# Altium project Turkin_IVT23_1D.PrjPcb
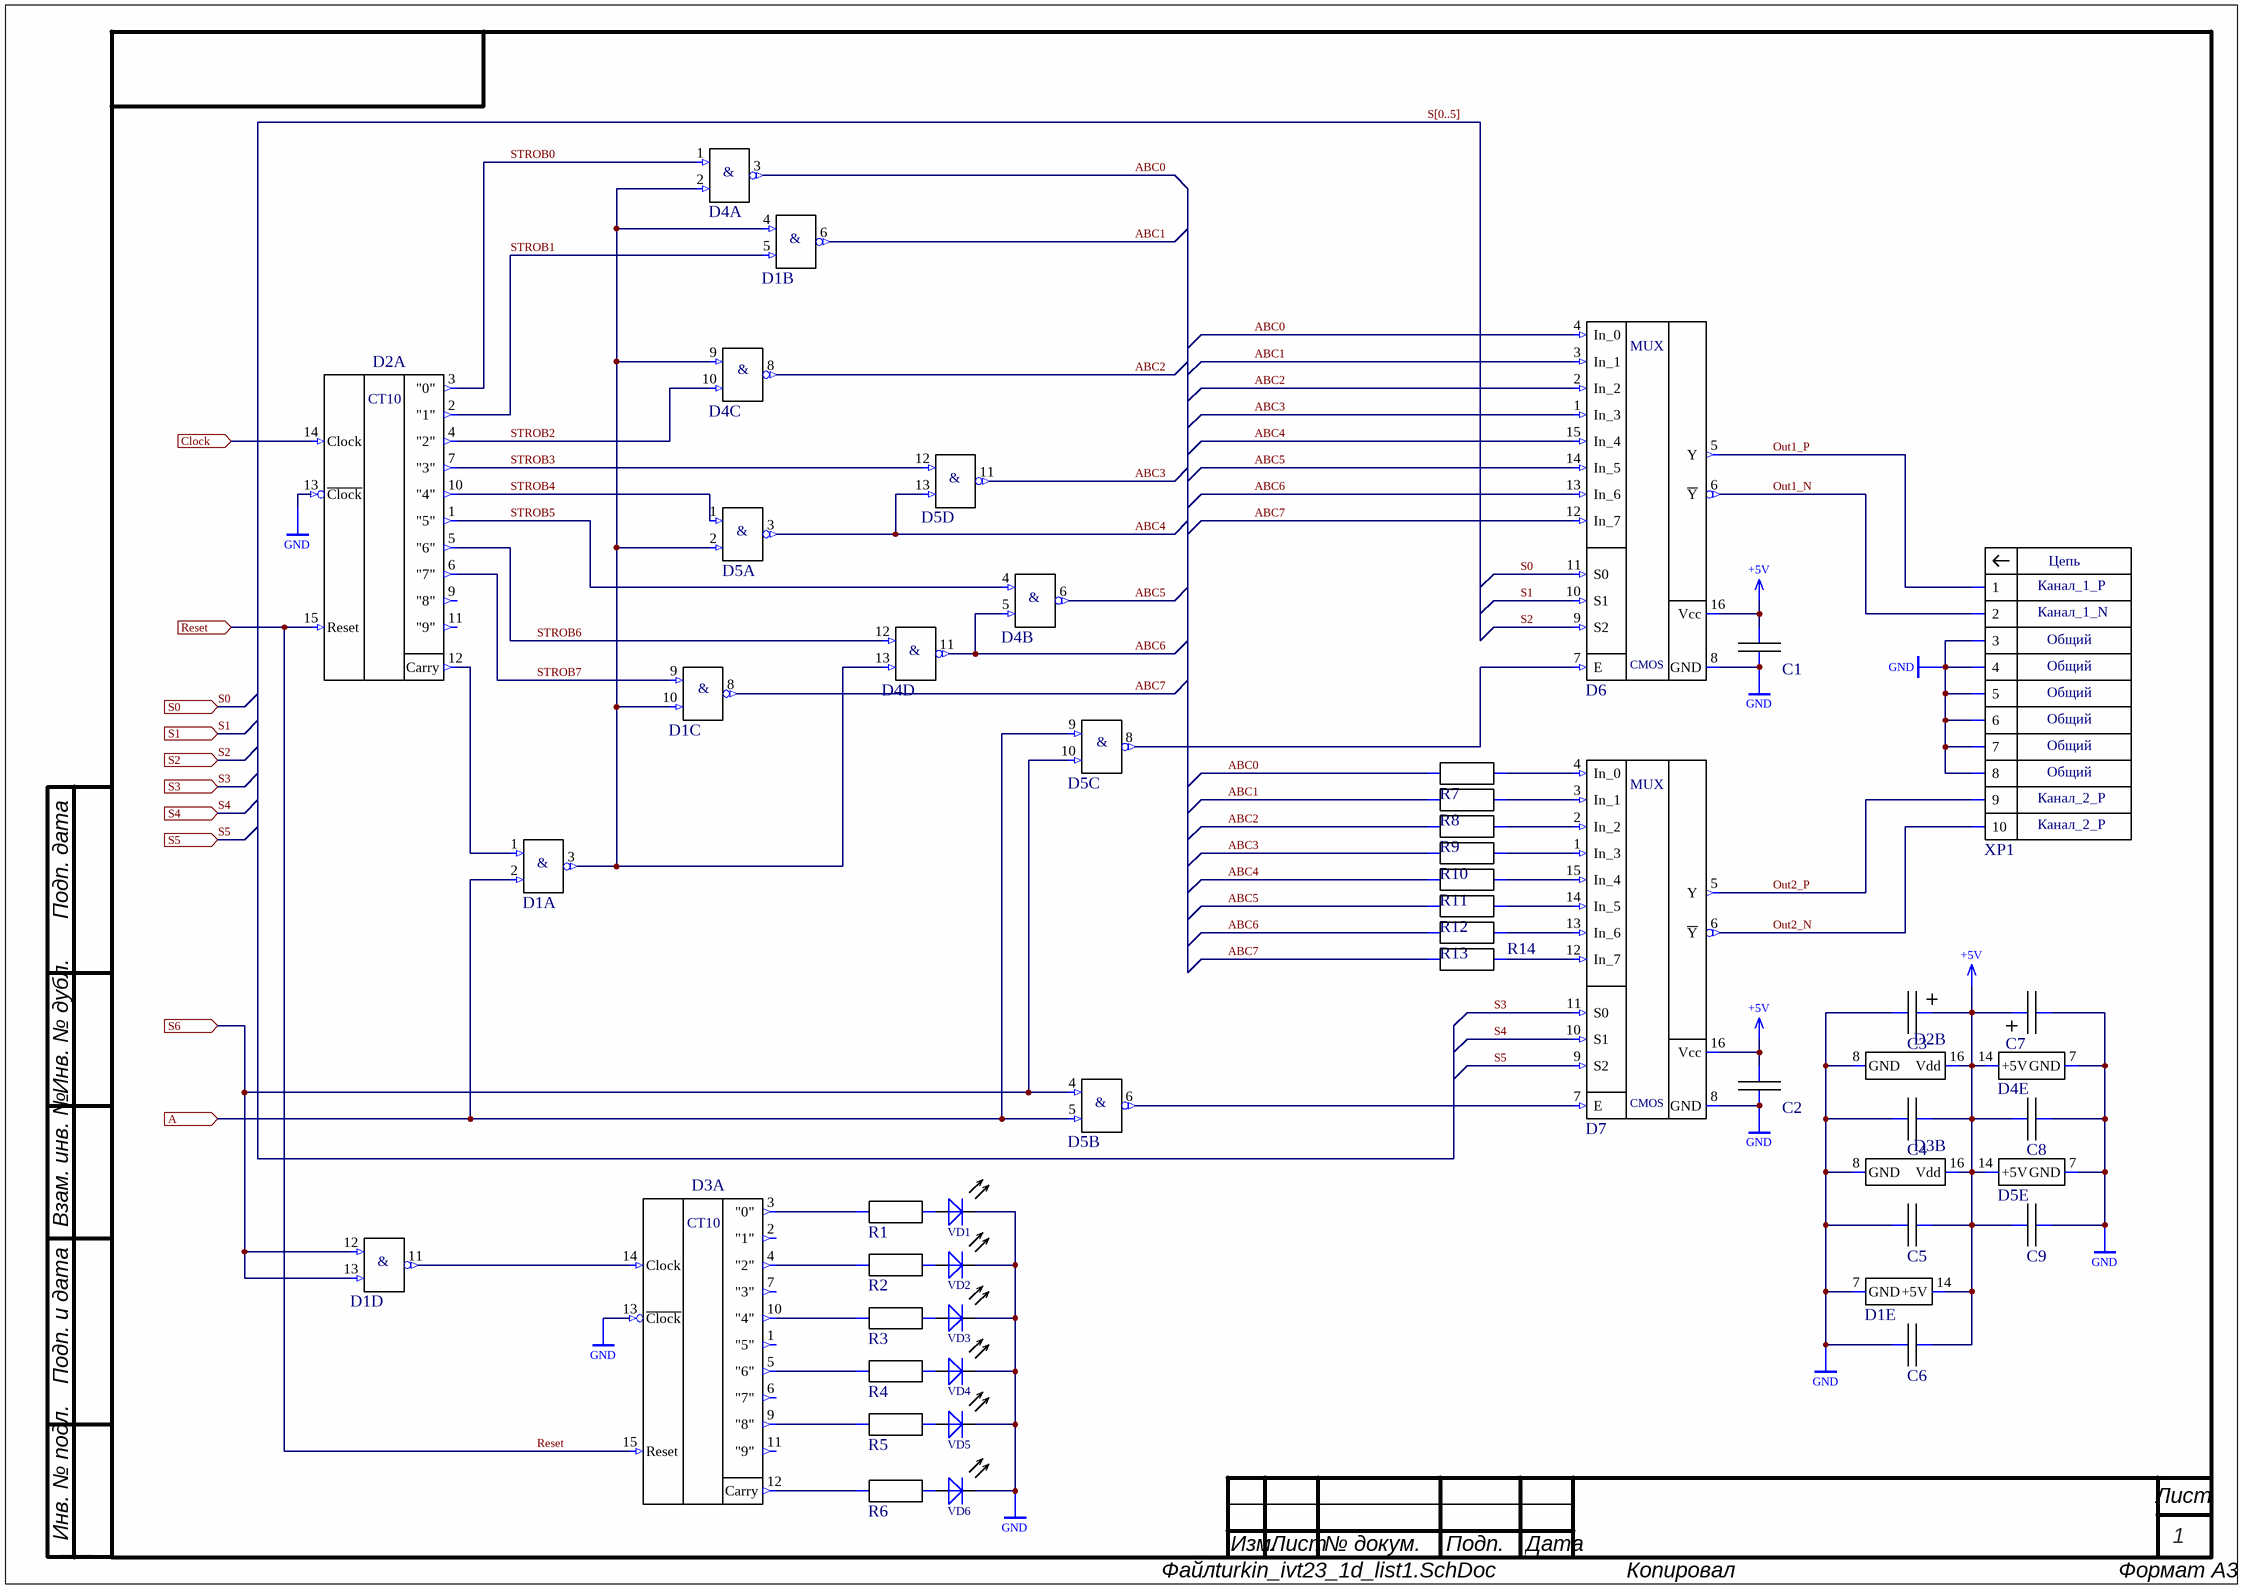
[diagram p0: turkin_ivt23_1d_list1.SchDoc]
2 sheets, 50 parts. Net scope: flat (ports and power ports of the same name join across sheets).
Board file: turkin_ivt23_1d_PCB1.PcbDoc
Sheets:
  turkin_ivt23_1d_list1.SchDoc
  turkin_ivt23_1d_list2.SchDoc

## Sheet turkin_ivt23_1d_list1.SchDoc
size 420 x 297 mm; SheetNumber: 1; SheetTotal: 2

### Parts
C1  (no value)  [0805_N]
C2  (no value)  [0805_N]
C3  C  [C-Tantal]  (value not drawn)
C4  (no value)  [0805_N]
C5  (no value)  [0805_N]
C6  (no value)  [0805_N]
C7  C  [C-Tantal]  (value not drawn)
C8  (no value)  [0805_N]
C9  (no value)  [0805_N]
D1  74AC00SC  [SO14-N]  (value not drawn)  (parts A,B,C,D,E of 5)
D2  DIP-16  [DIP16]  (value not drawn)  (parts A,B of 2)
D3  DIP-16  [DIP16]  (value not drawn)  (parts A,B of 2)
D4  74AC00SC  [SO14-N]  (value not drawn)  (parts A,B,C,D,E of 5)
D5  74AC00SC  [SO14-N]  (value not drawn)  (parts A,B,C,D,E of 5)
D6  SOIC-16  [SO16-N]  (value not drawn)
D7  SOIC-16  [SO16-N]  (value not drawn)
R1  0805  [RES_0805_2012_N]  (value not drawn)
R2  0805  [RES_0805_2012_N]  (value not drawn)
R3  0805  [RES_0805_2012_N]  (value not drawn)
R4  0805  [RES_0805_2012_N]  (value not drawn)
R5  0805  [RES_0805_2012_N]  (value not drawn)
R6  0805  [RES_0805_2012_N]  (value not drawn)
R7  0805  [RES_0805_2012_N]  (value not drawn)
R8  0805  [RES_0805_2012_N]  (value not drawn)
R9  0805  [RES_0805_2012_N]  (value not drawn)
R10  0805  [RES_0805_2012_N]  (value not drawn)
R11  0805  [RES_0805_2012_N]  (value not drawn)
R12  0805  [RES_0805_2012_N]  (value not drawn)
R13  0805  [RES_0805_2012_N]  (value not drawn)
R14  0805  [RES_0805_2012_N]  (value not drawn)
VD1  521-9466  [521-9466]  (value not drawn)
VD2  521-9466  [521-9466]  (value not drawn)
VD3  521-9466  [521-9466]  (value not drawn)
VD4  521-9466  [521-9466]  (value not drawn)
VD5  521-9466  [521-9466]  (value not drawn)
VD6  521-9466  [521-9466]  (value not drawn)
XP1  TE_1-1634689-0  [BH-10R]  (value not drawn)

### Ports
A (in), Clock (in), Reset (in), S0 (in), S1 (in), S2 (in), S3 (in), S4 (in), S5 (in), S6 (in)

### Nets
+5V: C1.2 C2.2 C3.+ C4.1 C5.1 C6.1 C7.+ C8.2 C9.2 D1.14(+5V) D2.16(Vdd) D3.16(Vdd) D4.14(+5V) D5.14(+5V) D6.16(Vcc) D7.16(Vcc)
GND: C1.1 C2.1 C3.- C4.2 C5.2 C6.2 C7.- C8.1 C9.1 D1.7(GND) D2.8(GND) D2.13(~{Clock}) D3.8(GND) D3.13(~{Clock}) D4.7(GND) D5.7(GND) D6.8(GND) D7.8(GND) VD1.C VD2.C VD3.C VD4.C VD5.C VD6.C XP1.3 XP1.4 XP1.5 XP1.6 XP1.7 XP1.8
ABC0: D4.3(Out) D6.4(In_0) R7.1
ABC1: D1.6(Out) D6.3(In_1) R8.1
ABC2: D4.8(Out) D6.2(In_2) R9.1
ABC3: D5.11(Out) D6.1(In_3) R10.1
ABC4: D5.3(Out) D5.13(In2) D6.15(In_4) R11.1
ABC5: D4.6(Out) D6.14(In_5) R12.1
ABC6: D4.5(In2) D4.11(Out) D6.13(In_6) R13.1
ABC7: D1.8(Out) D6.12(In_7) R14.1
Out1_N: D6.6(~{Y}) XP1.2
Out1_P: D6.5(Y) XP1.1
Out2_N: D7.6(~{Y}) XP1.10
Out2_P: D7.5(Y) XP1.9
Reset: D2.15(Reset) D3.15(Reset) ; port Reset
S0: D6.11(S0) ; port S0
S1: D6.10(S1) ; port S1
S2: D6.9(S2) ; port S2
S3: D7.11(S0) ; port S3
S4: D7.10(S1) ; port S4
S5: D7.9(S2) ; port S5
STROB0: D2.3("0") D4.1(In1)
STROB1: D1.5(In2) D2.2("1")
STROB2: D2.4("2") D4.10(In2)
STROB3: D2.7("3") D5.12(In1)
STROB4: D2.10("4") D5.1(In1)
STROB5: D2.1("5") D4.4(In1)
STROB6: D2.5("6") D4.12(In1)
STROB7: D1.9(In1) D2.6("7")
NetD1_1: D1.1(In1) D2.12(Carry)
NetD1_2: D1.2(In2) D5.5(In2) D5.9(In1) ; port A
NetD1_3: D1.3(Out) D1.4(In1) D1.10(In2) D4.2(In2) D4.9(In1) D4.13(In2) D5.2(In2)
NetD1_11: D1.11(Out) D3.14(Clock)
NetD1_12: D1.12(In1) D1.13(In2) D5.4(In1) D5.10(In2) ; port S6
NetD2_14: D2.14(Clock) ; port Clock
NetD3_3: D3.3("0") R1.1
NetD3_4: D3.4("2") R2.1
NetD3_5: D3.5("6") R4.1
NetD3_9: D3.9("8") R5.1
NetD3_10: D3.10("4") R3.1
NetD3_12: D3.12(Carry) R6.1
NetD5_6: D5.6(Out) D7.7(E)
NetD5_8: D5.8(Out) D6.7(E)
NetD7_1: D7.1(In_3) R10.2
NetD7_2: D7.2(In_2) R9.2
NetD7_3: D7.3(In_1) R8.2
NetD7_4: D7.4(In_0) R7.2
NetD7_12: D7.12(In_7) R14.2
NetD7_13: D7.13(In_6) R13.2
NetD7_14: D7.14(In_5) R12.2
NetD7_15: D7.15(In_4) R11.2
NetR1_2: R1.2 VD1.A
NetR2_2: R2.2 VD2.A
NetR3_2: R3.2 VD3.A
NetR4_2: R4.2 VD4.A
NetR5_2: R5.2 VD5.A
NetR6_2: R6.2 VD6.A

Not connected (* = marked no-connect by the designer): D2 9("8") 11("9"); D3 1("5") 2("1") 6("7") 7("3") 11("9")

### Buses and harness runs
bus S[0..5]

### Notes on the sheet
- (near XP1) Канал_1_P
- (near XP1) Канал_1_N
- Общий
- (near XP1) Канал_2_P
- Подп. дата
- Инв. № дубл.
- Взам. инв. №
- Подп. и дата
- Инв. № подл.
- Изм.
- Лист
- № докум.
- Подп.
- Дата
- ALTIUM GOSTBOM2.0 KEV
- Файл:
- Копировал
- Формат А3
- (in symbol 74AC00SC, part A) &
- (in symbol 74AC00SC, part B) &
- (in symbol 74AC00SC, part C) &
- (in symbol 74AC00SC, part D) &
- (in symbol 74HC151D) MUX; CMOS
- (in symbol HCF4017BEY, part A) CT10
- (in symbol TE_1-1634689-0) Цепь

### Library data of the parts
C1 C2 C4-C6 C8 C9 = К10-79_0805_Н90: Чип конденсатор 0805 Н90 ряд Е6; Manufacturer: ООО "Кулон"; Name: К10-79; Tolerance: +80%-20%; TU: АЖЯР.673511.004 ТУ; Type: K10-79; Voltage: 25В; Value: 0.1мкФ; BOM: К10-79-25В-B-*+80%-20%-Н90 АЖЯР.673511.004 ТУ; Created_by: Желобаев; Name2: Конденсатор К10-79; Version: 0; Weight: 0.05; TKE: Н90; Value_KD: *; Case: 0805; Issue_date: 19_12_2018
C3 C7 = K53-65_C_10%: К53-65 Конденсатор танталовый C(6032) 0,47-100 мкФ; Manufacturer: ОАО "Элеконд"; Value: 10мкФ; Voltage: 16В; TU: АЖЯР.673546.004 ТУ; Tolerance: 10%; Created_by: Желобаев; BOM: К53-65 "C" - 16ВB - 10мкФмкФ ±10% АЖЯР.673546.004 ТУ; Name2: Конденсатор К53-65; Weight: 0,3; Version: 0; Issue_date: 6.01.2019; Size: C; Name: К53-65; Case: C
D1 D4 D5 = 74AC00SC: 4 элемента 2И-НЕ TTL SOIC-14; Manufacturer: ON Semiconductor; BOM: 74AC00SC "ON Semiconductor"; Created_by: Желобаев; Power_Voltage: 4.5 - 5.5 V; Name2: Микросхема 74AC00SC; Issue_date: 10.04.2019; Case: SOIC-14; Version: 0; Name: 74AC00SC
D2 D3 = HCF4017BEY: Декадный счетчик c 10 декодированными выходами; Manufacturer: STMicroelectronics; Power_Voltage: -0.5 -22 V; BOM: HCF4017BEY "STMicroelectronics"; Created_by: Желобаев; Name2: Микросхема HCF4017BEY; Case: DIP-16; Issue_date: 05.04.2019; Name: HCF4017BEY; Version: 0
D6 D7 = 74HC151D: мультиплексор 8 канальный CMOS; Manufacturer: NXP Semiconductors; Power_Voltage: 2.0 -6.0 V; BOM: 74HC151D "NXP Semiconductors"; Created_by: Желобаев; NAME2: Микросхема 74HC151D; Case: SOIC-16; Issue_date: 05.04.2019; Name: 74HC151D; Version: 0
R1-R14 = Р1-12-0,125-5%: Резистор от 0,75 Ом до 2 МОм; Manufacturer: ОАО "НПО "Эркон"; Tolerance: 5%; Created_by: Желобаев; TU: АЛЯР.434110.005 ТУ; Voltage: 150; TKR: M; BOM: Р1-12-0,125 * 5%-M-"A" АЛЯР.434110.005 ТУ; Value: 270Ом; Name2: Резистор Р1-12-0,125; Issue_Date: 05_12_2018; Version: 00; Type: Р1-12-0,125±5%-М-"А"; Weight: 0,01; Size: 0805; Name: Р1-12-0,125; Value_KD: *; Case: 0805
VD1-VD6 = 521-9466: Светодиод 5мм желтый; BOM: 521-9466 Dialight
XP1 = TE_1-1634689-0: Вилка типа BH-10R угловая правая двухрядная 2х5х2.54; Manufacturer: TE Connectivity; Created_by: Желобаев; BOM: TE_1-1634689-0 "TE Connectivity"; Name2: Вилка угловая TE_1-1634689-0; Name: TE_1-1634689-0; Issue_date: 13.05.2019; Version: 0; Case: BH-10R

## Sheet turkin_ivt23_1d_list2.SchDoc
size 420 x 297 mm; SheetNumber: 2; SheetTotal: 2
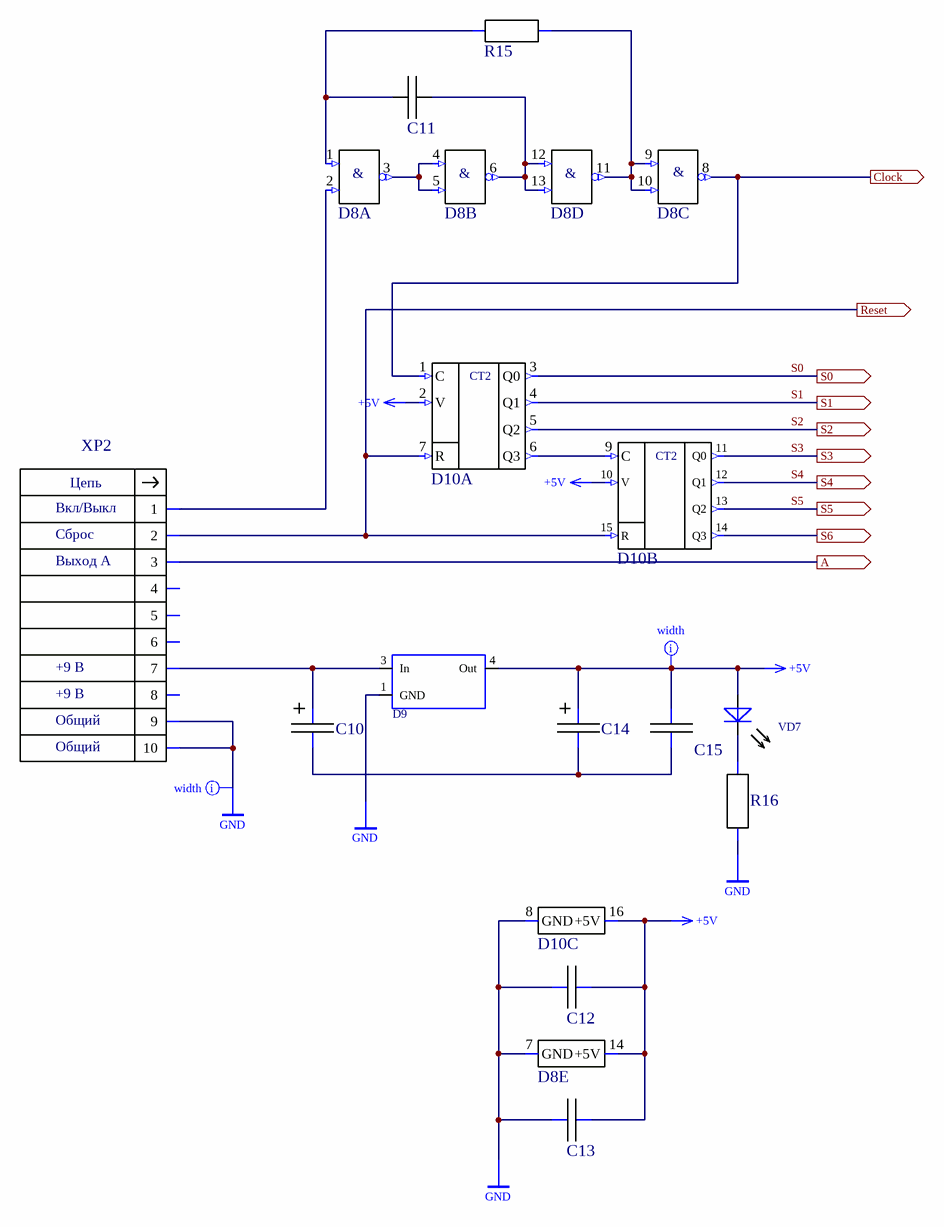
[diagram p1: turkin_ivt23_1d_list2.SchDoc]

### Parts
C10  C  [C-Tantal]  (value not drawn)
C11  1210  [K10-79_3.2_2.5(1210)]  (value not drawn)
C12  (no value)  [0805_N]
C13  (no value)  [0805_N]
C14  C  [C-Tantal]  (value not drawn)
C15  (no value)  [0805_N]
D8  74AC00SC  [SO14-N]  (value not drawn)  (parts A,B,C,D,E of 5)
D9  LM1117DTX-5.0/NOPB  [TO-252]  (value not drawn)
D10  (no value)  [DIP16]  (parts A,B,C of 3)
R15  (no value)  [RES_0603_1608_N]
R16  0805  [RES_0805_2012_N]  (value not drawn)
VD7  521-9466  [521-9466]  (value not drawn)
XP2  TE_1-1634689-0  [BH-10R]  (value not drawn)

### Ports
A (out), Clock (out), Reset (out), S0 (out), S1 (out), S2 (out), S3 (out), S4 (out), S5 (out), S6 (out)

### Nets
+5V: C12.2 C13.2 C14.+ C15.1 D8.14(+5V) D9.4(Out) D10.2(V) D10.10(V) D10.16(+5V) VD7.A
GND: C12.1 C13.1 D8.7(GND) D9.1(GND) D10.8(GND) R16.1 XP2.9 XP2.10
Reset: D10.7(R) D10.15(R) XP2.2 ; port Reset
S0: D10.3(Q0) ; port S0
S1: D10.4(Q1) ; port S1
S2: D10.5(Q2) ; port S2
S3: D10.11(Q0) ; port S3
S4: D10.12(Q1) ; port S4
S5: D10.13(Q2) ; port S5
NetC10_+: C10.+ D9.3(In) XP2.7
NetC10_-: C10.- C14.- C15.2
NetC11_1: C11.1 D8.1(In1) R15.1
NetC11_2: C11.2 D8.6(Out) D8.12(In1) D8.13(In2)
NetD1_2: XP2.3 ; port A
NetD1_12: D10.14(Q3) ; port S6
NetD2_14: D8.8(Out) D10.1(C) ; port Clock
NetD8_2: D8.2(In2) XP2.1
NetD8_3: D8.3(Out) D8.4(In1) D8.5(In2)
NetD8_9: D8.9(In1) D8.10(In2) D8.11(Out) R15.2
NetD10_6: D10.6(Q3) D10.9(C)
NetR16_2: R16.2 VD7.C

Not connected (* = marked no-connect by the designer): XP2 4 5 6 8

### Layout directives
mark named width: +5V, GND

### Notes on the sheet
- Сброс
- (near XP2) Вкл/Выкл
- Выход А
- +9 В
- Общий
- Подп. дата
- Инв. № дубл.
- Взам. инв. №
- Подп. и дата
- Инв. № подл.
- Изм.
- Лист
- № докум.
- Подп.
- Дата
- ALTIUM GOSTBOM2.0 KEV
- Файл:
- Копировал
- Формат А3
- (in symbol 74AC00SC, part A) &
- (in symbol 74AC00SC, part B) &
- (in symbol 74AC00SC, part C) &
- (in symbol 74AC00SC, part D) &
- (in symbol MC14520BCP, part A) CT2
- (in symbol MC14520BCP, part B) CT2
- (in symbol TE_1-1634689-0) Цепь

### Library data of the parts
C10 C14 = K53-65_C_10%: as C3 on sheet turkin_ivt23_1d_list1; Weight: 0,3; Version: 0; Issue_date: 6.01.2019; Size: C; Name: К53-65; Case: C
C11 = К10-79_1210_Н30: Чип конденсатор 1210 Н30 ряд Е6; Manufacturer: ООО "Кулон"; Name: Конденсатор К10-79; Reliability: 0.000005; Permit MPSU: разрешен; LiveStatus: производится; Packing: катушка; LibraryEngeneer: Желобаев; Tolerance: ±20%; Datum: 19_12_2018; TU: АЖЯР.673511.004 ТУ; Type: K10-79; Hight: 1.75; Voltage: 10В; Value_KD: 0.22мкФ; BOM: Конденсатор К10-79-10В-B-0.22мкФ±20%-Н30 АЖЯР.673511.004 ТУ; Version: 00; HelpURL: \\papa\Info\Altium_Library\Даташиты_и_ТУ\Конденсаторы_отечественные\К10-79_АЖЯР_673511_004ТУ.pdf; Weight: 0.2; TKE: Н30; Size: 1210; Value: *
C12 C13 C15 = К10-79_0805_Н90: as C1 on sheet turkin_ivt23_1d_list1; Version: 0; Weight: 0.05; TKE: Н90; Value_KD: *; Case: 0805; Issue_date: 19_12_2018
D8 = 74AC00SC: as D1 on sheet turkin_ivt23_1d_list1; Issue_date: 10.04.2019; Case: SOIC-14; Version: 0; Name: 74AC00SC
D10 = MC14520BCP: Два двоичных счетчика; Manufacturer: Motorola; Created_by: Желобаев; BOM: MC14520BCP "Motorola"; Name2: Микросхема MC14520BCP; Issue_date: 6.01.2019; Version: 0; Name: MC14520BCP; Case: DIP-16
R15 = Р1-12-0,1-5%: Резистор от 0,75 Ом до 10 МОм; Manufacturer: ОАО "НПО "Эркон"; Tolerance: 5%; TU: АЛЯР.434110.005 ТУ; Voltage: 50; TKR: M; BOM: Р1-12-0,1 * 5%-M-"A" АЛЯР.434110.005 ТУ; Value: 5.1КОм; Created_by: Желобаев; Name2: Резистор Р1-12-0,1; Version: 00; Type: Р1-12-0,1±5%-М-"А"; Weight: 0,005; Size: 0603; Name: Р1-12-0,1; Value_KD: *; Issue_date: 10.04.2019; Case: 0603
R16 = Р1-12-0,125-5%: as R1 on sheet turkin_ivt23_1d_list1; Issue_Date: 05_12_2018; Version: 00; Type: Р1-12-0,125±5%-М-"А"; Weight: 0,01; Size: 0805; Name: Р1-12-0,125; Value_KD: *; Case: 0805
VD7 = 521-9466: as VD1 on sheet turkin_ivt23_1d_list1
XP2 = TE_1-1634689-0: as XP1 on sheet turkin_ivt23_1d_list1; Name: TE_1-1634689-0; Issue_date: 13.05.2019; Version: 0; Case: BH-10R

## Nets that join several sheets
+5V: turkin_ivt23_1d_list1 (16 pins), turkin_ivt23_1d_list2 (10 pins)
GND: turkin_ivt23_1d_list1 (30 pins), turkin_ivt23_1d_list2 (8 pins)
NetD1_2: turkin_ivt23_1d_list1 (D1.2 D5.5 D5.9), turkin_ivt23_1d_list2 (XP2.3)
NetD1_12: turkin_ivt23_1d_list1 (D1.12 D1.13 D5.4 D5.10), turkin_ivt23_1d_list2 (D10.14)
NetD2_14: turkin_ivt23_1d_list1 (D2.14), turkin_ivt23_1d_list2 (D8.8 D10.1)
Reset: turkin_ivt23_1d_list1 (D2.15 D3.15), turkin_ivt23_1d_list2 (D10.7 D10.15 XP2.2)
S0: turkin_ivt23_1d_list1 (D6.11), turkin_ivt23_1d_list2 (D10.3)
S1: turkin_ivt23_1d_list1 (D6.10), turkin_ivt23_1d_list2 (D10.4)
S2: turkin_ivt23_1d_list1 (D6.9), turkin_ivt23_1d_list2 (D10.5)
S3: turkin_ivt23_1d_list1 (D7.11), turkin_ivt23_1d_list2 (D10.11)
S4: turkin_ivt23_1d_list1 (D7.10), turkin_ivt23_1d_list2 (D10.12)
S5: turkin_ivt23_1d_list1 (D7.9), turkin_ivt23_1d_list2 (D10.13)